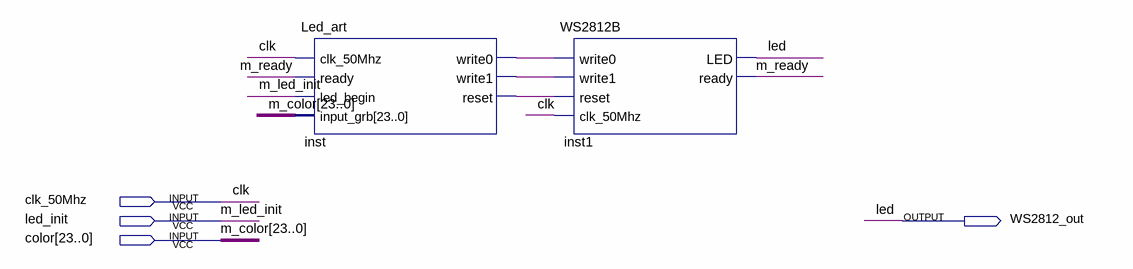
[diagram p0: schematic sheet]
// Quartus schematic WS2812_release.bdf as structural Verilog: 2 symbols, 4 pins
module WS2812_release (
  input  clk_50Mhz,
  input  led_init,
  input  [23:0] color,
  output WS2812_out
);

  wire inst_reset, inst_write0, inst_write1, m_ready;

  Led_art inst (
    .clk_50Mhz(clk_50Mhz), .ready(m_ready), .led_begin(led_init), .input_grb(color), .write0(inst_write0),
    .write1(inst_write1), .reset(inst_reset));
  WS2812B inst1 (
    .write0(inst_write0), .write1(inst_write1), .reset(inst_reset), .clk_50Mhz(clk_50Mhz), .LED(WS2812_out),
    .ready(m_ready));

  // Other names for the same wires on the sheet: clk = clk_50Mhz; led = WS2812_out; m_color[23:0] = color;
  //   m_led_init = led_init
endmodule
